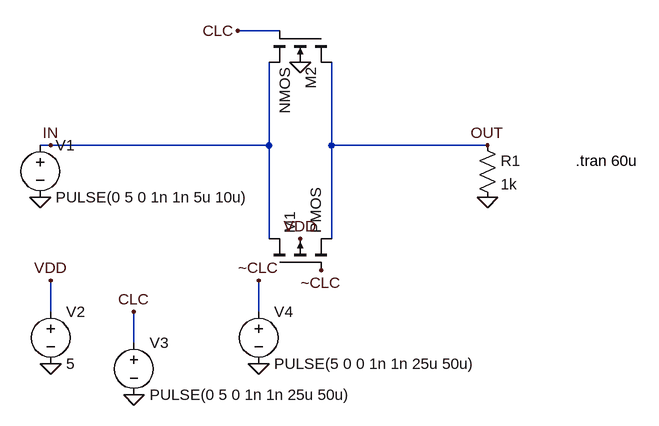
[diagram p0: schematic exp5 karan.asc]
exp5 karan.asc, the LTspice schematic file:
Version 4.1
SHEET 1 880 680
WIRE 176 -112 112 -112
WIRE -176 64 -192 64
WIRE 160 64 160 -64
WIRE 160 64 -176 64
WIRE 256 64 256 -64
WIRE 496 64 256 64
WIRE 160 208 160 64
WIRE 256 208 256 64
WIRE -176 320 -176 272
WIRE 144 320 144 272
WIRE -48 368 -48 320
FLAG -176 400 0
FLAG -48 448 0
FLAG 144 400 0
FLAG -192 144 0
FLAG 496 144 0
FLAG 208 -64 0
FLAG 112 -112 CLC
FLAG 144 272 ~CLC
FLAG 240 256 ~CLC
FLAG -48 320 CLC
FLAG -176 272 VDD
FLAG 208 208 VDD
FLAG 496 64 OUT
FLAG -176 64 IN
SYMBOL pmos4 160 256 R270
SYMATTR InstName M1
SYMBOL nmos4 256 -112 R90
SYMATTR InstName M2
SYMBOL res 480 48 R0
SYMATTR InstName R1
SYMATTR Value 1k
SYMBOL voltage -192 48 R0
WINDOW 123 0 0 Left 0
WINDOW 39 0 0 Left 0
SYMATTR InstName V1
SYMATTR Value PULSE(0 5 0 1n 1n 5u 10u)
SYMBOL voltage -176 304 R0
WINDOW 123 0 0 Left 0
WINDOW 39 0 0 Left 0
SYMATTR InstName V2
SYMATTR Value 5
SYMBOL voltage -48 352 R0
WINDOW 123 0 0 Left 0
WINDOW 39 0 0 Left 0
SYMATTR InstName V3
SYMATTR Value PULSE(0 5 0 1n 1n 25u 50u)
SYMBOL voltage 144 304 R0
WINDOW 123 0 0 Left 0
WINDOW 39 0 0 Left 0
SYMATTR InstName V4
SYMATTR Value PULSE(5 0 0 1n 1n 25u 50u)
TEXT 632 88 Left 2 !.tran 60u

The netlist it stands for:
* exp5 karan.asc
M1 IN ~CLC OUT VDD PMOS
M2 OUT CLC IN 0 NMOS
R1 OUT 0 1k
V1 IN 0 PULSE(0 5 0 1n 1n 5u 10u)
V2 VDD 0 5
V3 CLC 0 PULSE(0 5 0 1n 1n 25u 50u)
V4 ~CLC 0 PULSE(5 0 0 1n 1n 25u 50u)
.model NMOS NMOS
.model PMOS PMOS
.lib standard.mos
.tran 60u
.backanno
.end